# Altium schematic sheet 01_MAIN.SchDoc: =GlobalProjectName
size 594 x 420 mm; ApprovedBy: Галкин; CheckedBy: Галкин; Author: Данич; SheetNumber: 1; SheetTotal: 8; PageSetup: Record=PageOptions|CenterHorizontal=True|CenterVertical=True|PrintScale=0.70|XCorrection=1.00|YCorrection=1.00|PrintKind=2|BorderSize=5000000|LeftOffset=9000|BottomOffset=10100|Orientation=2|PaperLength=11176|PaperWidth=8636|Scale=100|PaperSource=259|PrintQuality=-3|MediaType=1|DitherType=10|PrintScaleMode=1|PaperKind=A3|PaperIndex=8
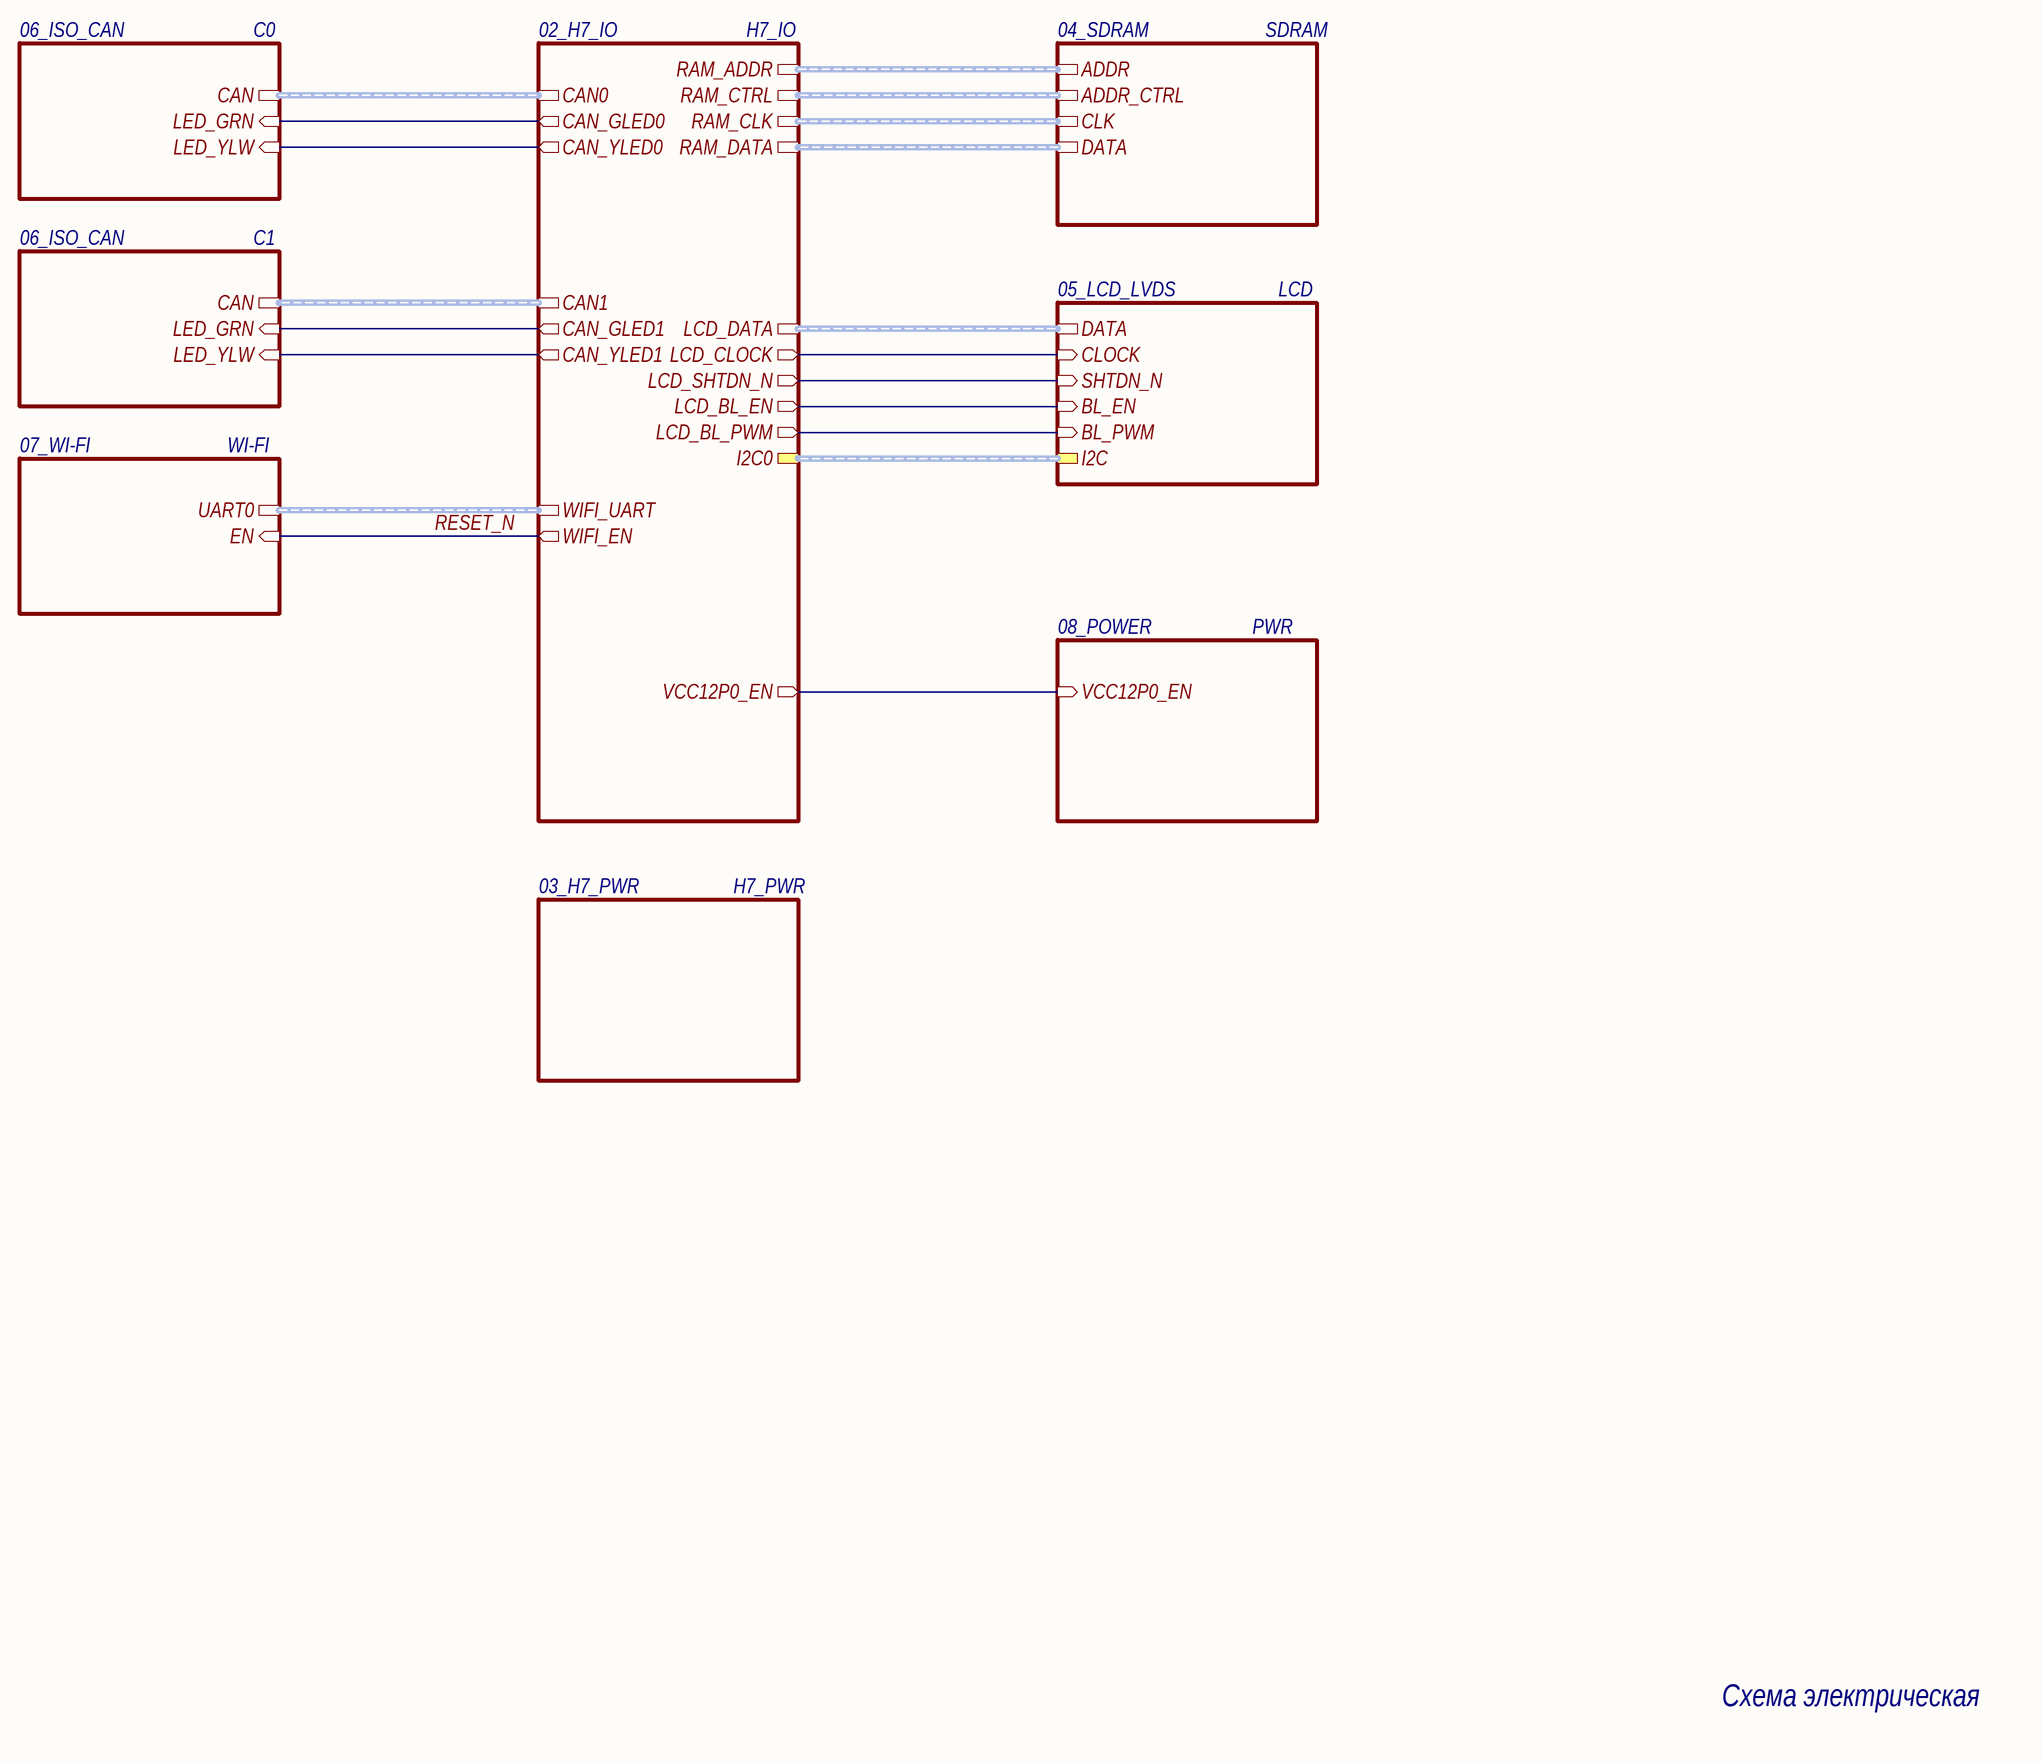
[diagram p0: 01_MAIN.SchDoc]

## Sub-sheets
C0 = 06_ISO_CAN: CAN (harness CAN), LED_GRN (in), LED_YLW (in)
C1 = 06_ISO_CAN: CAN (harness CAN), LED_GRN (in), LED_YLW (in)
H7_IO = 02_H7_IO: RAM_DATA (harness SDRAM_DQ), RAM_CTRL (harness SDRAM_ADDR_CTRL), RAM_CLK (harness SDRAM_CLK), RAM_ADDR (harness SDRAM_ADDR), LCD_DATA (harness LCD_DQ), LCD_CLOCK (out), LCD_SHTDN_N (out), CAN_GLED1 (out), CAN_YLED0 (out), CAN1 (harness CAN), CAN0 (harness CAN), WIFI_EN (out), CAN_GLED0 (out), WIFI_UART (harness UART0), CAN_YLED1 (out), LCD_BL_EN (out), LCD_BL_PWM (out), VCC12P0_EN (out), I2C0 (harness I2C)
H7_PWR = 03_H7_PWR: no entries
LCD = 05_LCD_LVDS: DATA (harness LCD_DQ), CLOCK (in), SHTDN_N (in), BL_PWM (in), BL_EN (in), I2C (harness I2C)
PWR = 08_POWER: VCC12P0_EN (in)
SDRAM = 04_SDRAM: DATA (harness SDRAM_DQ), ADDR_CTRL (harness SDRAM_ADDR_CTRL), CLK (harness SDRAM_CLK), ADDR (harness SDRAM_ADDR)
WI-FI = 07_WI-FI: EN (in), UART0 (harness UART0)

## Nets
RESET_N: sheet H7_IO/WIFI_EN, sheet WI-FI/EN
(unnamed): sheet H7_IO/LCD_CLOCK, sheet LCD/CLOCK
(unnamed): sheet H7_IO/LCD_SHTDN_N, sheet LCD/SHTDN_N
(unnamed): sheet H7_IO/CAN_GLED1, sheet C1/LED_GRN
(unnamed): sheet H7_IO/CAN_YLED0, sheet C0/LED_YLW
(unnamed): sheet H7_IO/CAN_GLED0, sheet C0/LED_GRN
(unnamed): sheet H7_IO/CAN_YLED1, sheet C1/LED_YLW
(unnamed): sheet H7_IO/LCD_BL_EN, sheet LCD/BL_EN
(unnamed): sheet H7_IO/LCD_BL_PWM, sheet LCD/BL_PWM
(unnamed): sheet H7_IO/VCC12P0_EN, sheet PWR/VCC12P0_EN

## Buses and harness runs
harness sheet C0/CAN = sheet H7_IO/CAN0
harness sheet C1/CAN = sheet H7_IO/CAN1
harness sheet H7_IO/I2C0 = sheet LCD/I2C
harness sheet H7_IO/LCD_DATA = sheet LCD/DATA
harness sheet H7_IO/RAM_ADDR = sheet SDRAM/ADDR
harness sheet H7_IO/RAM_CLK = sheet SDRAM/CLK
harness sheet H7_IO/RAM_CTRL = sheet SDRAM/ADDR_CTRL
harness sheet H7_IO/RAM_DATA = sheet SDRAM/DATA
harness sheet H7_IO/WIFI_UART = sheet WI-FI/UART0

## Notes on the sheet
- Схема электрическая
  принципиальная
- Перв. примен.
- Справ. №
- Подп. и дата
- Инв. № дубл.
- Взам. инв. №
- Разраб.
- Изм.
- Лист
- № докум.
- Подп.
- Дата
- Литера
- Масса
- Масштаб
- Пров.
- Т.контр.
- Листов
- Инв. № подл.
- Н.контр.
- Утв.
- Форма 1 ГОСТ 2.104-2006
- Копировал
- Формат А2